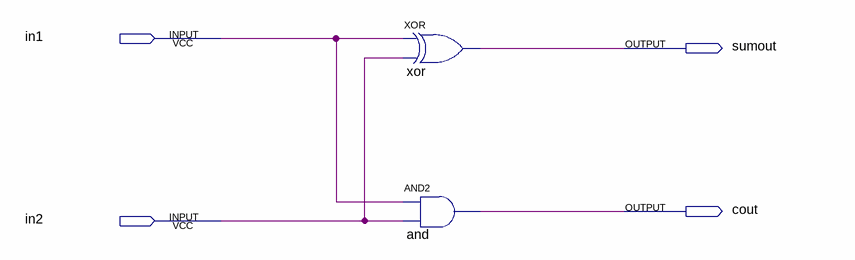
[diagram p0: schematic sheet]
// Quartus schematic half_adder.bdf as structural Verilog: 2 symbols, 4 pins
module half_adder (
  input  in1,
  input  in2,
  output sumout,
  output cout
);

  xor \xor  (sumout, in1, in2);
  and \and  (cout, in1, in2);
endmodule
